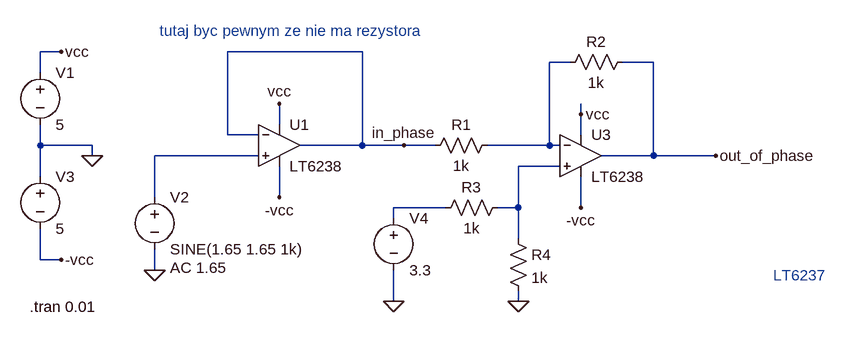
[diagram p0: schematic differential_output_LT6237.asc]
differential_output_LT6237.asc, the LTspice schematic file:
Version 4.1
SHEET 1 1224 680
WIRE -224 -96 -256 -96
WIRE 240 -96 32 -96
WIRE 560 -80 528 -80
WIRE 688 -80 640 -80
WIRE -256 -64 -256 -96
WIRE 576 0 576 -16
WIRE 112 16 112 -16
WIRE 32 32 32 -96
WIRE 80 32 32 32
WIRE 576 32 576 0
WIRE -256 48 -256 16
WIRE -176 48 -256 48
WIRE 240 48 240 -96
WIRE 240 48 144 48
WIRE 304 48 240 48
WIRE 352 48 304 48
WIRE 528 48 528 -80
WIRE 528 48 432 48
WIRE 544 48 528 48
WIRE -176 64 -176 48
WIRE 80 64 -80 64
WIRE 688 64 688 -80
WIRE 688 64 608 64
WIRE 784 64 688 64
WIRE 544 80 480 80
WIRE -256 96 -256 48
WIRE -80 128 -80 64
WIRE 112 128 112 80
WIRE 368 144 288 144
WIRE 480 144 480 80
WIRE 480 144 448 144
WIRE 576 144 576 96
WIRE 288 160 288 144
WIRE 480 192 480 144
WIRE -256 224 -256 176
WIRE -224 224 -256 224
WIRE -80 240 -80 208
WIRE 288 288 288 240
WIRE 480 288 480 272
FLAG -224 -96 vcc
FLAG 576 0 vcc
FLAG -80 240 0
FLAG 784 64 out_of_phase
FLAG 288 288 0
FLAG -176 64 0
FLAG 112 -16 vcc
FLAG 304 48 in_phase
FLAG 480 288 0
FLAG -224 224 -vcc
FLAG 112 128 -vcc
FLAG 576 144 -vcc
SYMBOL voltage -256 -80 R0
WINDOW 123 0 0 Left 0
WINDOW 39 0 0 Left 0
SYMATTR InstName V1
SYMATTR Value 5
SYMBOL voltage -80 112 R0
WINDOW 123 24 124 Left 2
WINDOW 39 0 0 Left 0
SYMATTR Value2 AC 1.65
SYMATTR InstName V2
SYMATTR Value SINE(1.65 1.65 1k)
SYMBOL res 448 32 R90
WINDOW 0 0 56 VBottom 2
WINDOW 3 32 56 VTop 2
SYMATTR InstName R1
SYMATTR Value 1k
SYMBOL res 656 -96 R90
WINDOW 0 0 56 VBottom 2
WINDOW 3 32 56 VTop 2
SYMATTR InstName R2
SYMATTR Value 1k
SYMBOL voltage 288 144 R0
WINDOW 123 0 0 Left 0
WINDOW 39 0 0 Left 0
SYMATTR InstName V4
SYMATTR Value 3.3
SYMBOL res 464 128 R90
WINDOW 0 0 56 VBottom 2
WINDOW 3 32 56 VTop 2
SYMATTR InstName R3
SYMATTR Value 1k
SYMBOL res 464 176 R0
SYMATTR InstName R4
SYMATTR Value 1k
SYMBOL voltage -256 80 R0
WINDOW 123 0 0 Left 0
WINDOW 39 0 0 Left 0
SYMATTR InstName V3
SYMATTR Value 5
SYMBOL OpAmps\\LT6238 576 64 R0
SYMATTR InstName U3
SYMBOL OpAmps\\LT6238 112 48 R0
SYMATTR InstName U1
TEXT -272 296 Left 2 !.tran 0.01
TEXT -72 -128 Left 2 ;tutaj byc pewnym ze nie ma rezystora
TEXT 872 248 Left 2 ;LT6237

The netlist it stands for:
* differential_output_LT6237.asc
V1 vcc 0 5
V2 N002 0 SINE(1.65 1.65 1k) AC 1.65
R1 N001 in_phase 1k
R2 out_of_phase N001 1k
V4 N004 0 3.3
R3 N003 N004 1k
R4 N003 0 1k
V3 0 -vcc 5
* U3: LT6238 (symbol OpAmps\LT6238 not available, pins judged from their places): In+=N003 In-=N001 V+=vcc V-=-vcc OUT=out_of_phase
* U1: LT6238 (symbol OpAmps\LT6238 not available, pins judged from their places): In+=N002 In-=in_phase V+=vcc V-=-vcc OUT=in_phase
.tran 0.01
* tutaj byc pewnym ze nie ma rezystora
* LT6237
.backanno
.end